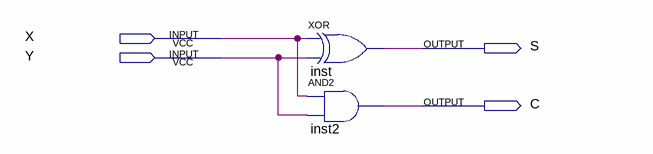
[diagram p0: schematic sheet]
// Quartus schematic MeioSomador.bdf as structural Verilog: 2 symbols, 4 pins
module MeioSomador (
  input  X,
  input  Y,
  output S,
  output C
);

  xor inst (S, X, Y);
  and inst2 (C, X, Y);
endmodule
